# Altium schematic sheet ASBB_MightyGecko.SchDoc
size A4
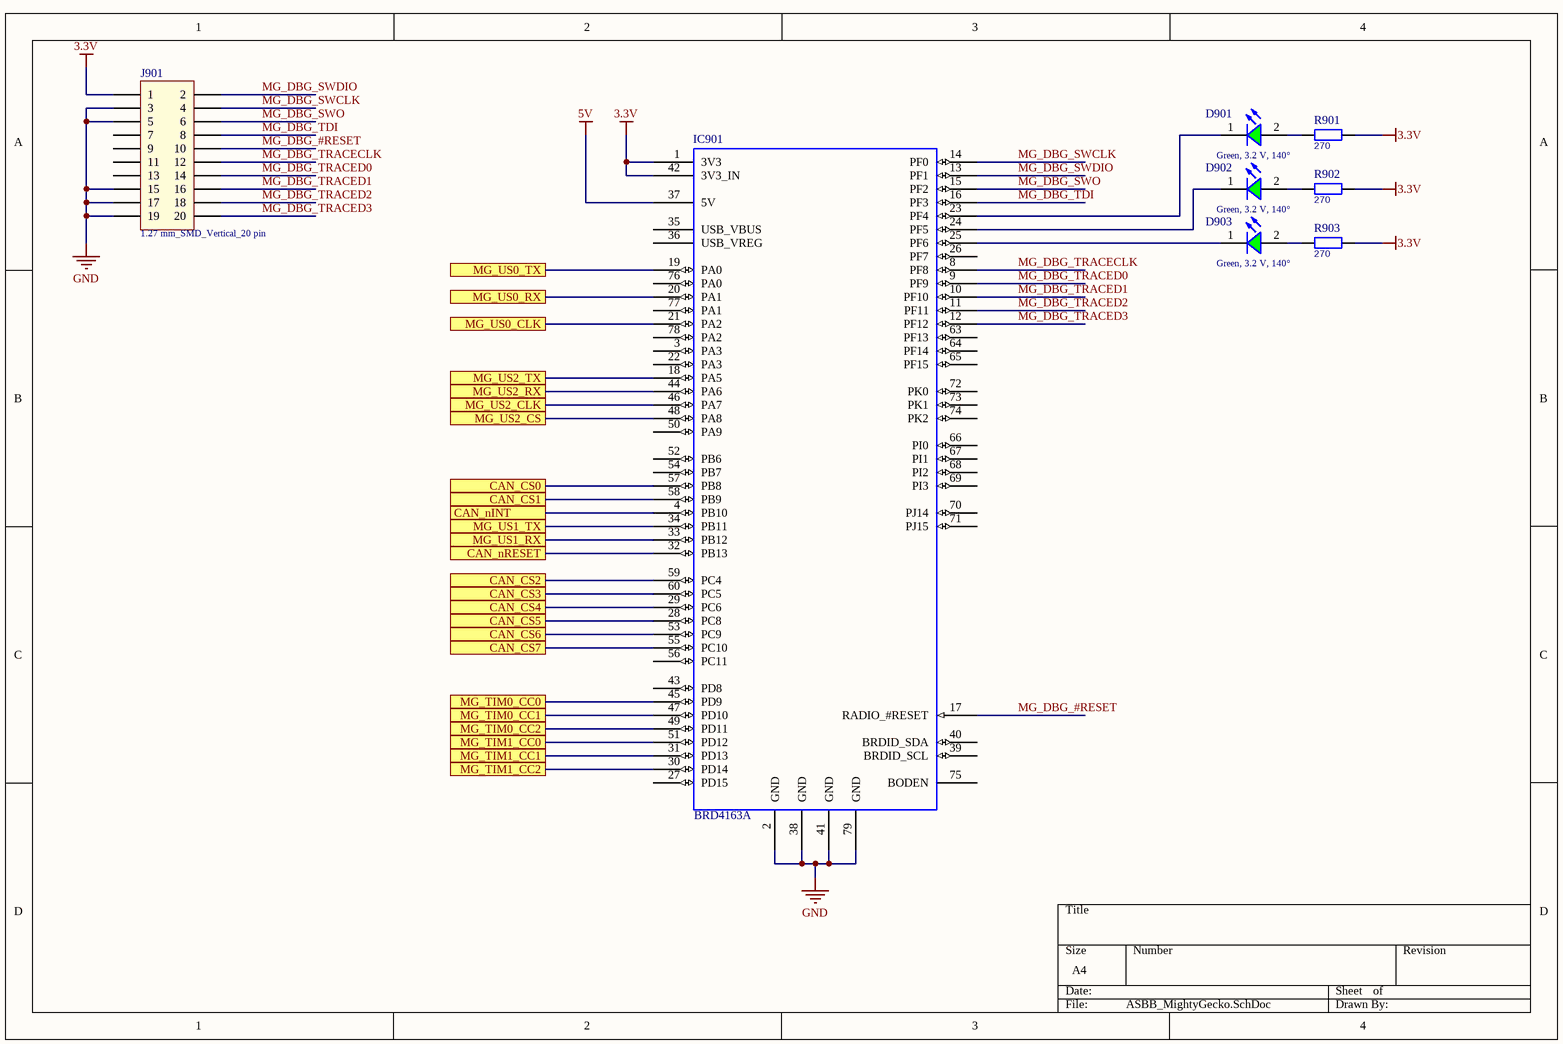
[diagram p0: ASBB_MightyGecko.SchDoc]

## Parts
D901  Green, 3.2 V, 140°  [WL-SMCW_0603]
D902  Green, 3.2 V, 140°  [WL-SMCW_0603]
D903  Green, 3.2 V, 140°  [WL-SMCW_0603]
IC901  BRD4163A  [80-Pin SiLabs Module]
J901  1.27 mm_SMD_Vertical_20 pin  [62102021021]
R901  270  [0603]
R902  270  [0603]
R903  270  [0603]

## Ports
CAN_CS0, CAN_CS1, CAN_CS2, CAN_CS3, CAN_CS4, CAN_CS5, CAN_CS6, CAN_CS7, CAN_nINT, CAN_nRESET, MG_TIM0_CC0, MG_TIM0_CC1, MG_TIM0_CC2, MG_TIM1_CC0, MG_TIM1_CC1, MG_TIM1_CC2, MG_US0_CLK, MG_US0_RX, MG_US0_TX, MG_US1_RX, MG_US1_TX, MG_US2_CLK, MG_US2_CS, MG_US2_RX, MG_US2_TX

## Nets
3.3V: IC901.1(3V3) IC901.42(3V3_IN) J901.1 R901.2 R902.2 R903.2
5V: IC901.37(5V)
GND: IC901.2(GND) IC901.38(GND) IC901.41(GND) IC901.79(GND) J901.3 J901.5 J901.15 J901.17 J901.19
CAN_CS0: IC901.57(PB8) ; port CAN_CS0
CAN_CS1: IC901.58(PB9) ; port CAN_CS1
CAN_CS2: IC901.59(PC4) ; port CAN_CS2
CAN_CS3: IC901.60(PC5) ; port CAN_CS3
CAN_CS4: IC901.29(PC6) ; port CAN_CS4
CAN_CS5: IC901.28(PC8) ; port CAN_CS5
CAN_CS6: IC901.53(PC9) ; port CAN_CS6
CAN_CS7: IC901.55(PC10) ; port CAN_CS7
CAN_nINT: IC901.4(PB10) ; port CAN_nINT
CAN_nRESET: IC901.32(PB13) ; port CAN_nRESET
MG_DBG_#RESET: IC901.17(RADIO_#RESET) J901.10
MG_DBG_SWCLK: IC901.14(PF0) J901.4
MG_DBG_SWDIO: IC901.13(PF1) J901.2
MG_DBG_SWO: IC901.15(PF2) J901.6
MG_DBG_TDI: IC901.16(PF3) J901.8
MG_DBG_TRACECLK: IC901.8(PF8) J901.12
MG_DBG_TRACED0: IC901.9(PF9) J901.14
MG_DBG_TRACED1: IC901.10(PF10) J901.16
MG_DBG_TRACED2: IC901.11(PF11) J901.18
MG_DBG_TRACED3: IC901.12(PF12) J901.20
MG_TIM0_CC0: IC901.45(PD9) ; port MG_TIM0_CC0
MG_TIM0_CC1: IC901.47(PD10) ; port MG_TIM0_CC1
MG_TIM0_CC2: IC901.49(PD11) ; port MG_TIM0_CC2
MG_TIM1_CC0: IC901.51(PD12) ; port MG_TIM1_CC0
MG_TIM1_CC1: IC901.31(PD13) ; port MG_TIM1_CC1
MG_TIM1_CC2: IC901.30(PD14) ; port MG_TIM1_CC2
MG_US0_CLK: IC901.21(PA2) ; port MG_US0_CLK
MG_US0_RX: IC901.20(PA1) ; port MG_US0_RX
MG_US0_TX: IC901.19(PA0) ; port MG_US0_TX
MG_US1_RX: IC901.33(PB12) ; port MG_US1_RX
MG_US1_TX: IC901.34(PB11) ; port MG_US1_TX
MG_US2_CLK: IC901.46(PA7) ; port MG_US2_CLK
MG_US2_CS: IC901.48(PA8) ; port MG_US2_CS
MG_US2_RX: IC901.44(PA6) ; port MG_US2_RX
MG_US2_TX: IC901.18(PA5) ; port MG_US2_TX
NetD901_1: D901.1(K) IC901.23(PF4)
NetD901_2: D901.2(A) R901.1
NetD902_1: D902.1(K) IC901.24(PF5)
NetD902_2: D902.2(A) R902.1
NetD903_1: D903.1(K) IC901.25(PF6)
NetD903_2: D903.2(A) R903.1

Not connected (* = marked no-connect by the designer): IC901 3(PA3) 5(NC) 6(NC) 7(NC) 22(PA3) 26(PF7) 27(PD15) 35(USB_VBUS) 36(USB_VREG) 39(BRDID_SCL) 40(BRDID_SDA) 43(PD8) 50(PA9) 52(PB6) 54(PB7) 56(PC11) 61(NC) 62(NC) 63(PF13) 64(PF14) 65(PF15) 66(PI0) 67(PI1) 68(PI2) 69(PI3) 70(PJ14) 71(PJ15) 72(PK0) 73(PK1) 74(PK2) 75(BODEN) 76(PA0) 77(PA1) 78(PA2) 80(NC); J901 7 9 11 13

## Library data of the parts
D901-D903 = 150060GS75000: WL-SMCW SMD Mono-color Chip LED Waterclear, size 0603, Green, 3.2 V, 140°; Forward Voltage: 3.2 V; Peak Wavelength: 515 nm; Dominant Wavelength: 525 nm; Luminous Intensity: 430 mcd; ComponentLink1Description: Manufacturer; ComponentLink1URL: http://www.we-online.de; ComponentLink2Description: Datasheet; ComponentLink2URL: http://katalog.we-online.de/led/datasheet/150060GS75000.pdf; Part Number: 150060GS75000; Published Date: May 2018; Publisher: Wurth Elektronik; Size: 0603; Viewing Angle: 140°; Operating Temperature: -40 to 85 degC; Emitting Color: Green; Mounting Technology: SMT
IC901 = SLWRB4163A
J901 = 62102021021: Pin Header WR-PHD, pitch 1.27 mm, SMD, Vertical, dual row, 20 pin; Rated Current: 1 A; Pin Number: 20; Pitch: 1.27 mm; Working Voltage: 100 VAC; Contact Resistance: 20 mOhm; Insulation Resistance: >1000 MOhm; ComponentLink1Description: Manufacturer; ComponentLink1URL: http://www.we-online.de; ComponentLink2Description: Datasheet; ComponentLink2URL: http://katalog.we-online.de/em/datasheet/62102021021.pdf; Part Number: 62102021021; Published Date: Jan. 2018; Publisher: Wurth Elektronik; Operating Temperature: -40 to 105 degC; Mounting Technology: SMD; Row Number: Dual; Orientation: Vertical
R901-R903 = Resistor: Partnumber: ?; Value: ?